# Altium schematic sheet wakerdimmer.schdoc
size 266 x 189 mm
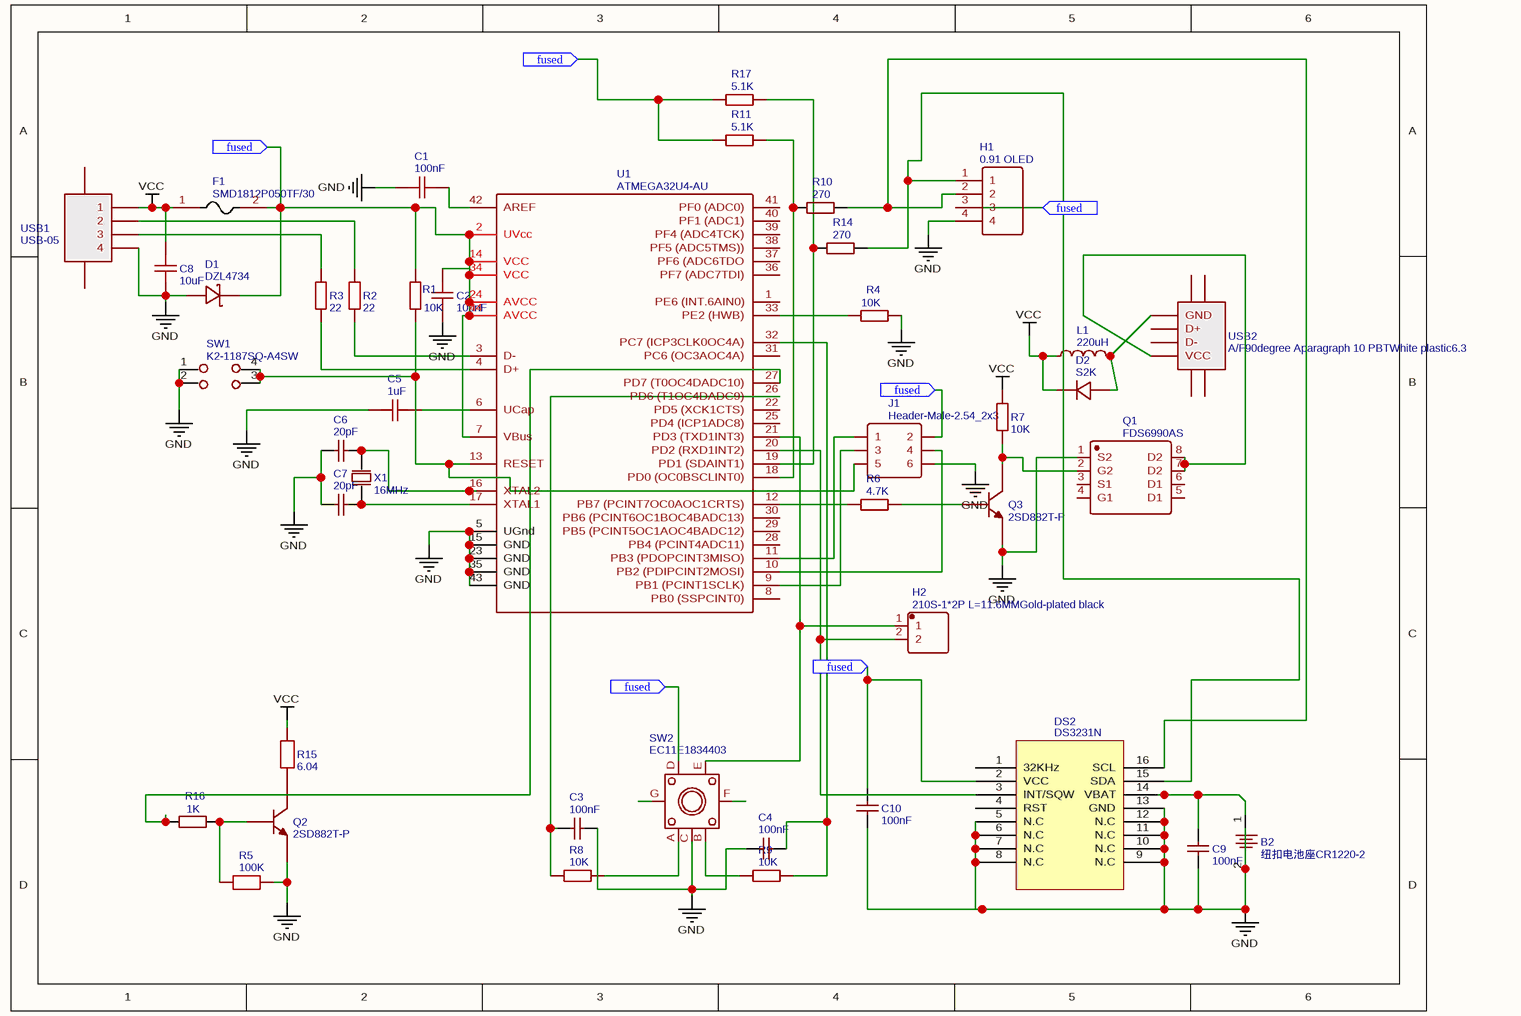
[diagram p0: wakerdimmer.schdoc]

## Parts
B2  纽扣电池座CR1220-2  [BATTERY-2]
C1  100nF  [CAP_0603]
C2  100nF  [CAP_0603]
C3  100nF  [0603]
C4  100nF  [0603]
C5  1uF  [CAP_0402]
C6  20pF  [0603]
C7  20pF  [0603]
C8  10uF  [1206]
C9  100nF  [0805]
C10  100nF  [0805]
D1  DZL4734  [SOD-123F]
D2  S2K  [SMA]
DS2  DS3231N  [DS3231SN]
F1  SMD1812P050TF/30  [1812]
H1  0.91 OLED  [DIP-1X4P2.54]
H2  210S-1*2P L=11.6MMGold-plated black  [210S-1X2P]
J1  Header-Male-2.54_2x3  [HDR-TH_6PIN-V-ROW2-COL3-MALE-PITCH2.54]
L1  220uH  [L185152]
Q1  FDS6990AS  [SOIC-8_150MIL]
Q2  2SD882T-P  [SOT-89(SOT-89-3)]
Q3  2SD882T-P  [SOT-89(SOT-89-3)]
R1  10K  [0603]
R2  22  [0603]
R3  22  [0603]
R4  10K  [0603]
R5  100K  [RES_0603]
R6  4.7K  [0603]
R7  10K  [0603]
R8  10K  [0603]
R9  10K  [0603]
R10  270  [0603]
R11  5.1K  [0603]
R14  270  [0603]
R15  6.04  [RES_1206]
R16  1K  [0603]
R17  5.1K  [0603]
SW1  K2-1187SQ-A4SW  [KEY-5.2*5.2]
SW2  EC11E1834403  [EC11E1834403]
U1  ATMEGA32U4-AU  [QFP-44_10X10X08P]
USB1  USB-05  [USB-M-48]
USB2  A/F90degree Aparagraph 10 PBTWhite plastic6.3  [USB-M-35]
X1  16MHz  [OSC-49S-1]

## Ports
fused

## Nets
GND: B2.2 C1.1 C2.1 C3.2 C4.1 C5.2 C6.1 C7.1 C8.1 C9.2 C10.2 D1.1(A) DS2.5(N.C) DS2.6(N.C) DS2.7(N.C) DS2.8(N.C) DS2.9(N.C) DS2.10(N.C) DS2.11(N.C) DS2.12(N.C) DS2.13(GND) H1.4 J1.6 Q1.1(S2) Q2.3(E) Q3.3(E) R4.2 R5.2 SW1.1 SW1.2 SW2.C U1.5(UGnd) U1.15(GND) U1.23(GND) U1.35(GND) U1.43(GND) USB1.4
VCC: C8.2 D2.2 F1.1 L1.1 R7.2 R15.2 USB1.1
fused: C2.2 C10.1 D1.2(K) DS2.2(VCC) F1.2 H1.3 J1.2 R1.2 R11.1 R17.1 SW2.D U1.2(UVcc) U1.7(VBus) U1.14(VCC) U1.24(AVCC) U1.34(VCC) U1.44(AVCC) ; port fused
NetB2_1: B2.1 C9.1 DS2.14(VBAT)
NetC1_2: C1.2 U1.42(AREF)
NetC3_1: C3.1 R8.1 U1.26(PD6_(T1OC4DADC9))
NetC4_2: C4.2 R9.2 U1.32(PC7_(ICP3CLK0OC4A))
NetC5_1: C5.1 U1.6(UCap)
NetC6_2: C6.2 U1.16(XTAL2) X1.1(OSC1)
NetC7_2: C7.2 U1.17(XTAL1) X1.2(OSC2)
NetD2_1: D2.1 L1.2 USB2.4(GND)
NetDS2_3: DS2.3(INT/SQW) H2.2 U1.20(PD2_(RXD1INT2))
NetDS2_15: DS2.15(SDA) H1.1 R14.2
NetDS2_16: DS2.16(SCL) H1.2 R10.2
NetH2_1: H2.1 SW2.E U1.21(PD3_(TXD1INT3))
NetJ1_1: J1.1 U1.11(PB3_(PDOPCINT3MISO))
NetJ1_3: J1.3 U1.9(PB1_(PCINT1SCLK))
NetJ1_4: J1.4 U1.10(PB2_(PDIPCINT2MOSI))
NetJ1_5: J1.5 R1.1 SW1.3 SW1.4 U1.13(RESET)
NetQ1_2: Q1.2(G2) Q3.2(C) R7.1
NetQ1_7: Q1.7(D2) Q1.8(D2) USB2.1(VCC)
NetQ2_1: Q2.1(B) R5.1 R16.2
NetQ2_2: Q2.2(C) R15.1
NetQ3_1: Q3.1(B) R6.2
NetR2_1: R2.1 U1.3(D-)
NetR2_2: R2.2 USB1.2
NetR3_1: R3.1 U1.4(D+)
NetR3_2: R3.2 USB1.3
NetR4_1: R4.1 U1.33(PE2_(HWB))
NetR6_1: R6.1 U1.12(PB7_(PCINT7OC0AOC1CRTS))
NetR8_2: R8.2 SW2.A
NetR9_1: R9.1 SW2.B
NetR10_1: R10.1 R11.2 U1.18(PD0_(OC0BSCLINT0))
NetR14_1: R14.1 R17.2 U1.19(PD1_(SDAINT1))
NetR16_1: R16.1 U1.27(PD7_(T0OC4DADC10))

Not connected (* = marked no-connect by the designer): DS2 1(32KHz) 4(RST); Q1 3(S1) 4(G1) 5(D1) 6(D1); SW2 F G; U1 1(PE6_(INT.6AIN0)) 8(PB0_(SSPCINT0)) 22(PD5_(XCK1CTS)) 25(PD4_(ICP1ADC8)) 28(PB4_(PCINT4ADC11)) 29(PB5_(PCINT5OC1AOC4BADC12)) 30(PB6_(PCINT6OC1BOC4BADC13)) 31(PC6_(OC3AOC4A)) 36(PF7_(ADC7TDI)) 37(PF6_(ADC6TDO) 38(PF5_(ADC5TMS))) 39(PF4_(ADC4TCK)) 40(PF1_(ADC1)) 41(PF0_(ADC0)); USB1 0 6; USB2 0 2(D-) 3(D+)

## Library data of the parts
B2 = 纽扣电池座CR1220-2: BOM_Manufacturer: Q&J; BOM_Supplier Part: C70381; BOM_Supplier: LCSC; BOM_Manufacturer Part: CR1220-2; image: //image.lceda.cn/szlcsc/C70381.jpg; spicePre: B
C1 C2 = 100nF: BOM_Manufacturer: TDK; BOM_Manufacturer Part: CGA3E3X8R1H104KT0Y0N; nameAlias: Capacitance; Contributor: LCSC; BOM_Supplier: LCSC; BOM_Supplier Part: C342825; spicePre: C; spiceSymbolName: CGA3E3X8R1H104KT0Y0N
C3 C4 = 100nF: BOM_Manufacturer: TORCH; BOM_Manufacturer Part: CT41G-0603-2X1-50V-0.1μF-K(N); nameAlias: Capacitance; Contributor: LCSC; BOM_Supplier: LCSC; BOM_Supplier Part: C125205; spicePre: C; spiceSymbolName: CT41G-0603-2X1-50V-0.1μF-K(N)
C5 = 1uF: BOM_Manufacturer: Taiyo Yuden; BOM_Manufacturer Part: EMK105BJ105KVHF; nameAlias: Capacitance; Contributor: LCSC; BOM_Supplier: LCSC; BOM_Supplier Part: C385891; spicePre: C; spiceSymbolName: EMK105BJ105KVHF
C6 C7 = 20pF: BOM_Manufacturer Part: CL10C200JB8NNNC; BOM_Manufacturer: SAMSUNG; nameAlias: Capacitance; SMT Type: Basic; BOM_Supplier: LCSC; BOM_LCSC Assembly: Yes; BOM_Supplier Part: C1648; spicePre: C; spiceSymbolName: CL10C200JB8NNNC
C8 = 10uF: BOM_Manufacturer: Taiyo Yuden; BOM_Manufacturer Part: EMK316AB7106KL-T; nameAlias: Capacitance; Contributor: LCSC; BOM_Supplier: LCSC; BOM_Supplier Part: C319199; spicePre: C; spiceSymbolName: EMK316AB7106KL-T
C9 C10 = 100nF: BOM_Manufacturer: MuRata; BOM_Manufacturer Part: GRJ21BR71H104KE01L; nameAlias: Capacitance; BOM_Supplier: LCSC; BOM_Supplier Part: C112618; spicePre: C; spiceSymbolName: GRJ21BR71H104KE01L
D1 = DZL4734: BOM_Manufacturer: LGE; Contributor: LCSC; BOM_Supplier: LCSC; BOM_Supplier Part: C362311; BOM_Manufacturer Part: DZL4734; spicePre: D
D2 = S2K: BOM_Manufacturer: LGE; Contributor: LCSC; BOM_Supplier: LCSC; BOM_Supplier Part: C330220; BOM_Manufacturer Part: -; spicePre: D
DS2 = DS3231N: Contributor: 122089121; BOM_Manufacturer Part: ?; spicePre: D
F1 = SMD1812P050TF/30: BOM_Manufacturer: RUILON; SMT Type: Extend; BOM_Supplier: LCSC; BOM_Manufacturer Part: SMD1812P050TF/30; image: //image.lceda.cn/szlcsc/C12559.jpg; BOM_Supplier Part: C12559; BOM_LCSC Assembly: Yes; spicePre: F
H1 = 0.91 OLED: BOM_Manufacturer: Ckmtw; BOM_Manufacturer Part: 220S-1*4P H=8.5MM Ytype Gold-plated; Contributor: LCSC; BOM_Supplier: LCSC; BOM_Supplier Part: C124413; spicePre: H
H2 = 210S-1*2P L=11.6MMGold-plated black: BOM_Manufacturer: Ckmtw; Contributor: LCSC; BOM_Supplier: LCSC; BOM_Manufacturer Part: 210S-1*2P L=11.6MMGold-plated black; BOM_Supplier Part: C124375; spicePre: H
J1 = Header-Male-2.54_2x3: BOM_Manufacturer: BOOMELE; BOM_Supplier: LCSC; BOM_Manufacturer Part: Header-Male-2.54_2x3; BOM_Supplier Part: C65114; spicePre: J
L1 = 220uH: BOM_Manufacturer: Abracon LLC; BOM_Manufacturer Part: ASPI-1306T-221M-T; nameAlias: Inductance; Contributor: LCSC; BOM_Supplier: LCSC; BOM_Supplier Part: C187417; spicePre: L; spiceSymbolName: ASPI-1306T-221M-T
Q1 = FDS6990AS: BOM_Manufacturer: FAIRCHILD; SMT Type: Extend; BOM_Supplier: LCSC; BOM_Manufacturer Part: FDS6990AS; BOM_Supplier Part: C51459; BOM_LCSC Assembly: Yes; spicePre: Q
Q2 Q3 = 2SD882T-P: BOM_Manufacturer: BLUE ROCKET; Contributor: LCSC; SMT Type: Extend; BOM_Supplier: LCSC; BOM_Supplier Part: C305479; BOM_Manufacturer Part: 2SD882T-P; BOM_LCSC Assembly: Yes; spicePre: Q
R1 R4 R7-R9 = 10K: BOM_Manufacturer: Stackpole Elec; BOM_Manufacturer Part: RMCF0603JT10K0; nameAlias: Resistance (Ohms); Contributor: LCSC; BOM_Supplier: LCSC; BOM_Supplier Part: C238881; spicePre: R; spiceSymbolName: RMCF0603JT10K0
R2 R3 = 22: BOM_Manufacturer: ResistorToday; BOM_Manufacturer Part: ETCR0603F22R0K9; nameAlias: Resistance (Ohms); Contributor: LCSC; BOM_Supplier: LCSC; BOM_Supplier Part: C365407; spicePre: R; spiceSymbolName: ETCR0603F22R0K9
R5 = 100K: BOM_Manufacturer: ResistorToday; BOM_Manufacturer Part: PTFR0603B100KN9; nameAlias: Value; Contributor: LCSC; BOM_Supplier: LCSC; BOM_Supplier Part: C394537; spicePre: R; spiceSymbolName: PTFR0603B100KN9
R6 = 4.7K: BOM_Manufacturer: Tyohm; BOM_Manufacturer Part: RMC06034.7K1%N; nameAlias: Resistance (Ohms); Contributor: LCSC; BOM_Supplier: LCSC; BOM_Supplier Part: C269713; spicePre: R; spiceSymbolName: RMC06034.7K1%N
R10 R14 = 270: BOM_Manufacturer: UniOhm; BOM_Manufacturer Part: 0603WAJ0271T5E; nameAlias: Resistance (Ohms); BOM_Supplier: LCSC; BOM_Supplier Part: C25223; spicePre: R; spiceSymbolName: 0603WAJ0271T5E
R11 R17 = 5.1K: BOM_Manufacturer: Tyohm; BOM_Manufacturer Part: RMC06035.1K1%N; nameAlias: Resistance (Ohms); Contributor: LCSC; BOM_Supplier: LCSC; BOM_Supplier Part: C269716; spicePre: R; spiceSymbolName: RMC06035.1K1%N
R15 = 6.04: BOM_Manufacturer: Walsin Tech Corp; BOM_Manufacturer Part: WR12W6R04FTL; nameAlias: Resistance (Ohms); Contributor: LCSC; BOM_Supplier: LCSC; BOM_Supplier Part: C368086; spicePre: R; spiceSymbolName: WR12W6R04FTL
R16 = 1K: BOM_Manufacturer: UniOhm; BOM_Manufacturer Part: 0603WAF1001T5E; nameAlias: Resistance (Ohms); SMT Type: Basic; BOM_Supplier: LCSC; BOM_LCSC Assembly: Yes; BOM_Supplier Part: C21190; spicePre: R; spiceSymbolName: 0603WAF1001T5E
SW1 = K2-1187SQ-A4SW: BOM_Manufacturer: HRO; BOM_Supplier: LCSC; BOM_Manufacturer Part: K2-1187SQ-A4SW; BOM_Supplier Part: C92584; spicePre: S
SW2 = EC11E1834403: BOM_Manufacturer: ALPS Electric; Contributor: LCSC; BOM_Supplier: LCSC; BOM_Supplier Part: C361165; BOM_Manufacturer Part: EC11E1834403; spicePre: S
U1 = ATMEGA32U4-AU: BOM_Manufacturer: MICROCHIP; SMT Type: Extend; BOM_Supplier: LCSC; BOM_Manufacturer Part: ATMEGA32U4-AU; image: //image.lceda.cn/szlcsc/C44854.jpg; BOM_Supplier Part: C44854; BOM_LCSC Assembly: Yes; spicePre: U
USB1 = USB-05: BOM_Manufacturer: SOFNG; Contributor: LCSC; BOM_Supplier: LCSC; BOM_Manufacturer Part: USB-05; BOM_Supplier Part: C112454; spicePre: U
USB2 = A/F90degree Aparagraph 10 PBTWhite plastic6.3: BOM_Manufacturer: ValuePro; BOM_Supplier: LCSC; BOM_Manufacturer Part: A/F90degree Aparagraph 10 PBTWhite plastic6.3; image: //image.lceda.cn/szlcsc/C42576.jpg; BOM_Supplier Part: C42576; spicePre: U
X1 = 16MHz: BOM_Manufacturer: YXC; BOM_Manufacturer Part: X49SD16MSD2SC; nameAlias: Frequency; BOM_Supplier: LCSC; BOM_Supplier Part: C16212; spicePre: X; spiceSymbolName: X49SD16MSD2SC